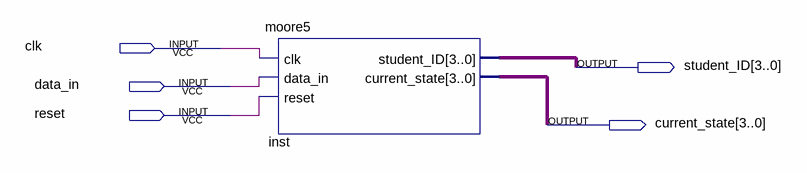
[diagram p0: schematic sheet]
// Quartus schematic test_moore.bdf as structural Verilog: 1 symbols, 5 pins
module test_moore (
  input  clk,
  input  data_in,
  input  reset,
  output [3:0] student_ID,
  output [3:0] current_state
);

  moore5 inst (.clk(clk), .data_in(data_in), .reset(reset), .student_ID(student_ID), .current_state(current_state));
endmodule
